# Altium schematic sheet POWER CON.SchDoc: Power Connector
size B; CheckedBy: Lance Bantoto; Engineer: Cindy Li; Organization: Altium Limited; Address1: L3, 12a Rodborough Rd; Address2: Frenchs Forest; Address3: NSW; Address4: Australia 2086; DocumentNumber: 2; Revision: 1; SheetNumber: 2; SheetTotal: 26
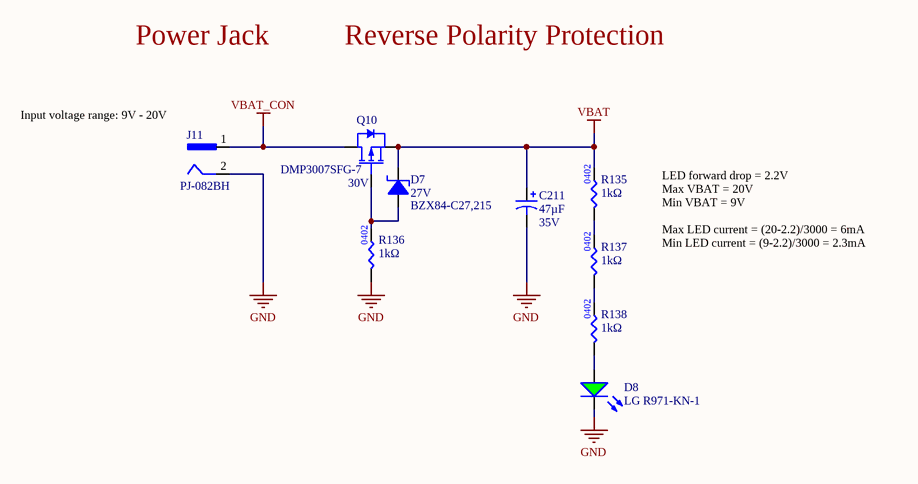
[diagram p0: POWER CON.SchDoc]

## Parts
C211  value 47µF  Voltage Rating: 35V  [RADIAL_CORNELL_D]  (hidden comment: CAP_47uF_35V_ALUM)
D7  Manufacturer Part Number 1: BZX84-C27,215  Working Voltage: 27V  [SOT23-3]  (hidden comment: DIO_ZENER_27V)
D8  Manufacturer Part Number 1: LG R971-KN-1  [LED_0805_GREEN]  (hidden comment: DIO_LED_G)
J11  Manufacturer Part Number 1: PJ-082BH  [CUI_PJ-082BH]  (hidden comment: CON_POWER_JACK)
Q10  Vdss: 30V  [DMP3007SFG-7]  (hidden comment: PMOS_30V_70A)
R135  Resistance: 1kΩ  [RES0402]  (hidden comment: RES_1kΩ_0402)
R136  Resistance: 1kΩ  [RES0402]  (hidden comment: RES_1kΩ_0402)
R137  Resistance: 1kΩ  [RES0402]  (hidden comment: RES_1kΩ_0402)
R138  Resistance: 1kΩ  [RES0402]  (hidden comment: RES_1kΩ_0402)

## Nets
GND: C211.2 D8.2(K) J11.2 R136.1
VBAT: C211.1 D7.2(Cathode) Q10.3(Source) R135.2
VBAT_CON: J11.1 Q10.1(Drain)
NetD7_1: D7.1(Anode) Q10.2(Gate) R136.2
NetD8_1: D8.1(A) R138.1
NetR135_1: R135.1 R137.2
NetR137_1: R137.1 R138.2

## Notes on the sheet
- Power Jack
- Reverse Polarity Protection
- (near J11) Input voltage range: 9V - 20V
- LED forward drop = 2.2V
  Max VBAT = 20V
  Min VBAT = 9V
  Max LED current = (20-2.2)/3000 = 6mA
  Min LED current = (9-2.2)/3000 = 2.3mA
- Title:
- Project:
- Date:
- Rev:
- Reviewer:
- Engineer:
- Sheet:
- of

## Library data of the parts
C211 = CAP_47uF_35V_ALUM: CAP ALUM POLY HYB 47UF 35V SMD; Manufacturer 1: Cornell Dubilier Electronics (CDE); Manufacturer Part Number 1: HZA476M035D16T-F; Supplier 1: Digi-Key; Supplier Part Number 1: HZA476M035D16T-FCT-ND; Mounting Type: SMD; Package/Footprint: SMD
D7 = DIO_ZENER_27V: DIODE ZENER 27V 250MW SOT23; Manufacturer 1: Nexperia USA Inc.; Forward Voltage: 0.9V; Supplier Part Number 1: 1727-5026-2-ND; Supplier 1: Digi-Key; Package/Case: SOT-23-3
D8 = DIO_LED_G: LED GREEN DIFFUSED 0805 SMD; Manufacturer 1: OSRAM; Forward Voltage Drop: 2.2V; Package/Footprint: 0805; Supplier Part Number 1: 475-1410-1-ND; Supplier 1: Digi-Key; Mounting Type: SMD
J11 = CON_POWER_JACK: 2.5 x 6.5 mm, 10.0 A, Horizontal, Through Hole, Shielded, Dc Power Jack Connector; Manufacturer 1: CUI Devices; Voltage Rating: 24VDC; Current Rating: 10A; Supplier 1: Digi-Key; Supplier Part Number 1: CP-082BHCT-ND
Q10 = PMOS_30V_70A: MOSFET P-CH 30V 70A POWERDI3333; Manufacturer 1: Diodes Incorporated; Vgs (Max): 25V; Power Dissipation (Max): 2.8W (Ta); Package/Footprint: PowerDI3333-8; Supplier 1: Digi-Key; Supplier Part Number 1: DMP3007SFG-7DICT-ND; Manufacturer Part Number 1: DMP3007SFG-7; Mounting Type: SMD; Verified: No; Id: 70A
R135-R138 = RES_1kΩ_0402: Fixed Resistor, Metal Glaze/thick Film, 0.063W, 1000ohm, 50V, 1% +/-Tol, 100ppm/Cel, Surface Mount, 0402; Manufacturer: Stackpole Electronics; Manufacturer Part Number: RMCF0402FT1K00; Rated Power Dissipation (P): 63mW; Rated Temperature: 70°C; Temperature Coefficient: 100ppm/°C; Package Height: 0.3mm; Package Length: 1mm; Package Width: 0.5mm; Reference Standard: AEC-Q200; Supplier 1: Digi-Key; Supplier Part Number 1: RMCF0402FT1K00CT-ND; RoHS: Yes; Category: Chip SMD Resistors; Stock 1: 277; Pricing 1: 1=0.10000, 10=0.01500, 100=0.00610, 1000=0.00274, 2500=0.00238, 5000=0.00197 (USD); Mount: Surface Mount; Number of Pins: 2; Package Shape: Rectangular; Terminal Finish: Nickel; Min Operating Temperature: -55°C; Max Operating Temperature: 155°C; Tolerance: 1%; JESD-609 Code: e3; Resistor Type: FIXED RESISTOR; Construction: Rectangular; Package Style: SMTMeter; Packaging: Tape and Reel; Technology: METAL GLAZE/THICK FILM; Termination: Wraparound; Working Voltage: 50V; REACH SVHC: Yes; RoHS Compliant: Yes; ComponentLink1URL: https://datasheet.ciiva.com:443/pdfs/VipMasterIC/IC/SEIE/SEIE-S-A0009541969/SEIE-S-A0009541969-1.pdf?src-supplier=IHS+Markit; ComponentLink1Description: https://datasheet.ciiva.com:443/pdfs/VipMasterIC/IC/SEIE/SEIE-S-A0009541969/SEIE-S-A0009541969-1.pdf?src-supplier=IHS+Markit; ComponentLink2URL: https://datasheet.ciiva.com/15193/getdatasheetpartid-365385-15193418.pdf?src-supplier=Verical; ComponentLink2Description: https://datasheet.ciiva.com/15193/getdatasheetpartid-365385-15193418.pdf?src-supplier=Verical; ComponentLink3URL: https://datasheet.ciiva.com/24336/sei-rmcp-24336266.pdf?src-supplier=Onlinecomponents.com; ComponentLink3Description: https://datasheet.ciiva.com/24336/sei-rmcp-24336266.pdf?src-supplier=Onlinecomponents.com; Size Code: 0402